# Altium schematic sheet heater_solenoid_control.SchDoc
size A
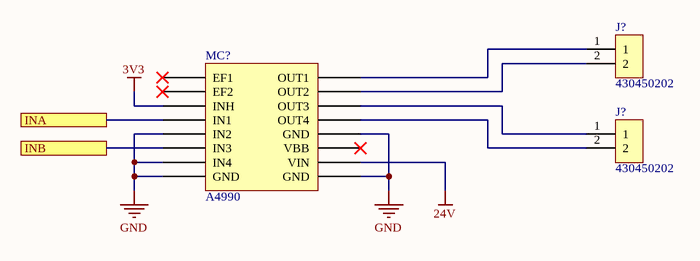
[diagram p0: heater_solenoid_control.SchDoc]

## Parts
(Parts that share a designator on the sheet are numbered #1, #2 ... from top to bottom, then left to right.)
J?#1  MFG P/N: 430450202  [MOLEX_430450202]  (hidden comment: __Template_Connector_1X2)
J?#2  MFG P/N: 430450202  [MOLEX_430450202]  (hidden comment: __Template_Connector_1X2)
MC?  A4990  [A4990 Dual Motor Driver Carrier]

## Ports
INA, INB

## Nets
3V3: MC?.3(INH)
24V: MC?.10(VIN)
GND: MC?.5(IN2) MC?.7(IN4) MC?.8(GND) MC?.9(GND) MC?.12(GND)
INA: MC?.4(IN1) ; port INA
INB: MC?.6(IN3) ; port INB
NetJ?#1_1: J?#1.1 MC?.16(OUT1)
NetJ?#1_2: J?#1.2 MC?.15(OUT2)
NetJ?#2_1: J?#2.1 MC?.14(OUT3)
NetJ?#2_2: J?#2.2 MC?.13(OUT4)

Not connected (* = marked no-connect by the designer): MC? 1(EF1)* 2(EF2)* 11(VBB)*

## Library data of the parts
J?#1 J?#2 = 958: CONN, HDR, R/A, 2x1, 3MM P, 7.37MM H, GOLD, TH; ID: 958; MFG: Molex, LLC; Connector Type: Header; Pitch: 3.00mm; Number of Positions: 2; Gender: Male; Current Rating: 8A; Voltage, Rated: 600V; Status: Released; RoHS Compliant: Yes; Mounting Type: Through Hole; Orientation: Right Angle; Number of Rows: 1; Features: Board Lock; Supplier 1: Digi-Key; HelpURL: https://www.digikey.in/product-detail/en/molex-llc/0430450202/WM1819-ND/252532; ComponentLink1Description: Datasheet; ComponentLink1URL: https://www.molex.com/pdm_docs/sd/430450202_sd.pdf; Supplier Part Number 1: WM1819-ND
MC? = A4990 Dual Motor Driver Carrier